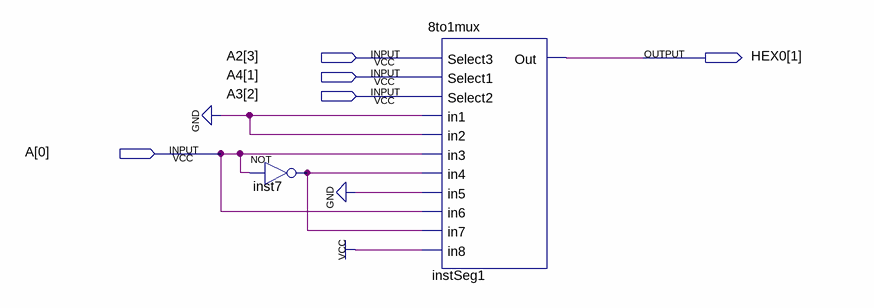
[diagram p0: schematic sheet]
// Quartus schematic seg1.bdf as structural Verilog: 2 symbols, 5 pins
module seg1 (
  input  [3:3] A2,
  input  [1:1] A4,
  input  [2:2] A3,
  input  [0:0] A,
  output [1:1] HEX0
);

  wire inst7_out;

  not inst7 (inst7_out, A[0]);
  \8to1mux  instSeg1 (
    .Select3(A2[3]), .Select1(A4[1]), .Select2(A3[2]), .in1(1'b0), .in2(1'b0), .in3(A[0]), .in4(inst7_out),
    .in5(1'b0), .in6(A[0]), .in7(inst7_out), .in8(1'b1), .Out(HEX0[1]));
endmodule
